# Altium schematic sheet CPU - Power.SchDoc: Title
size Tabloid; Revision: A; ProjectTitle: CDU: CAN Display Unit
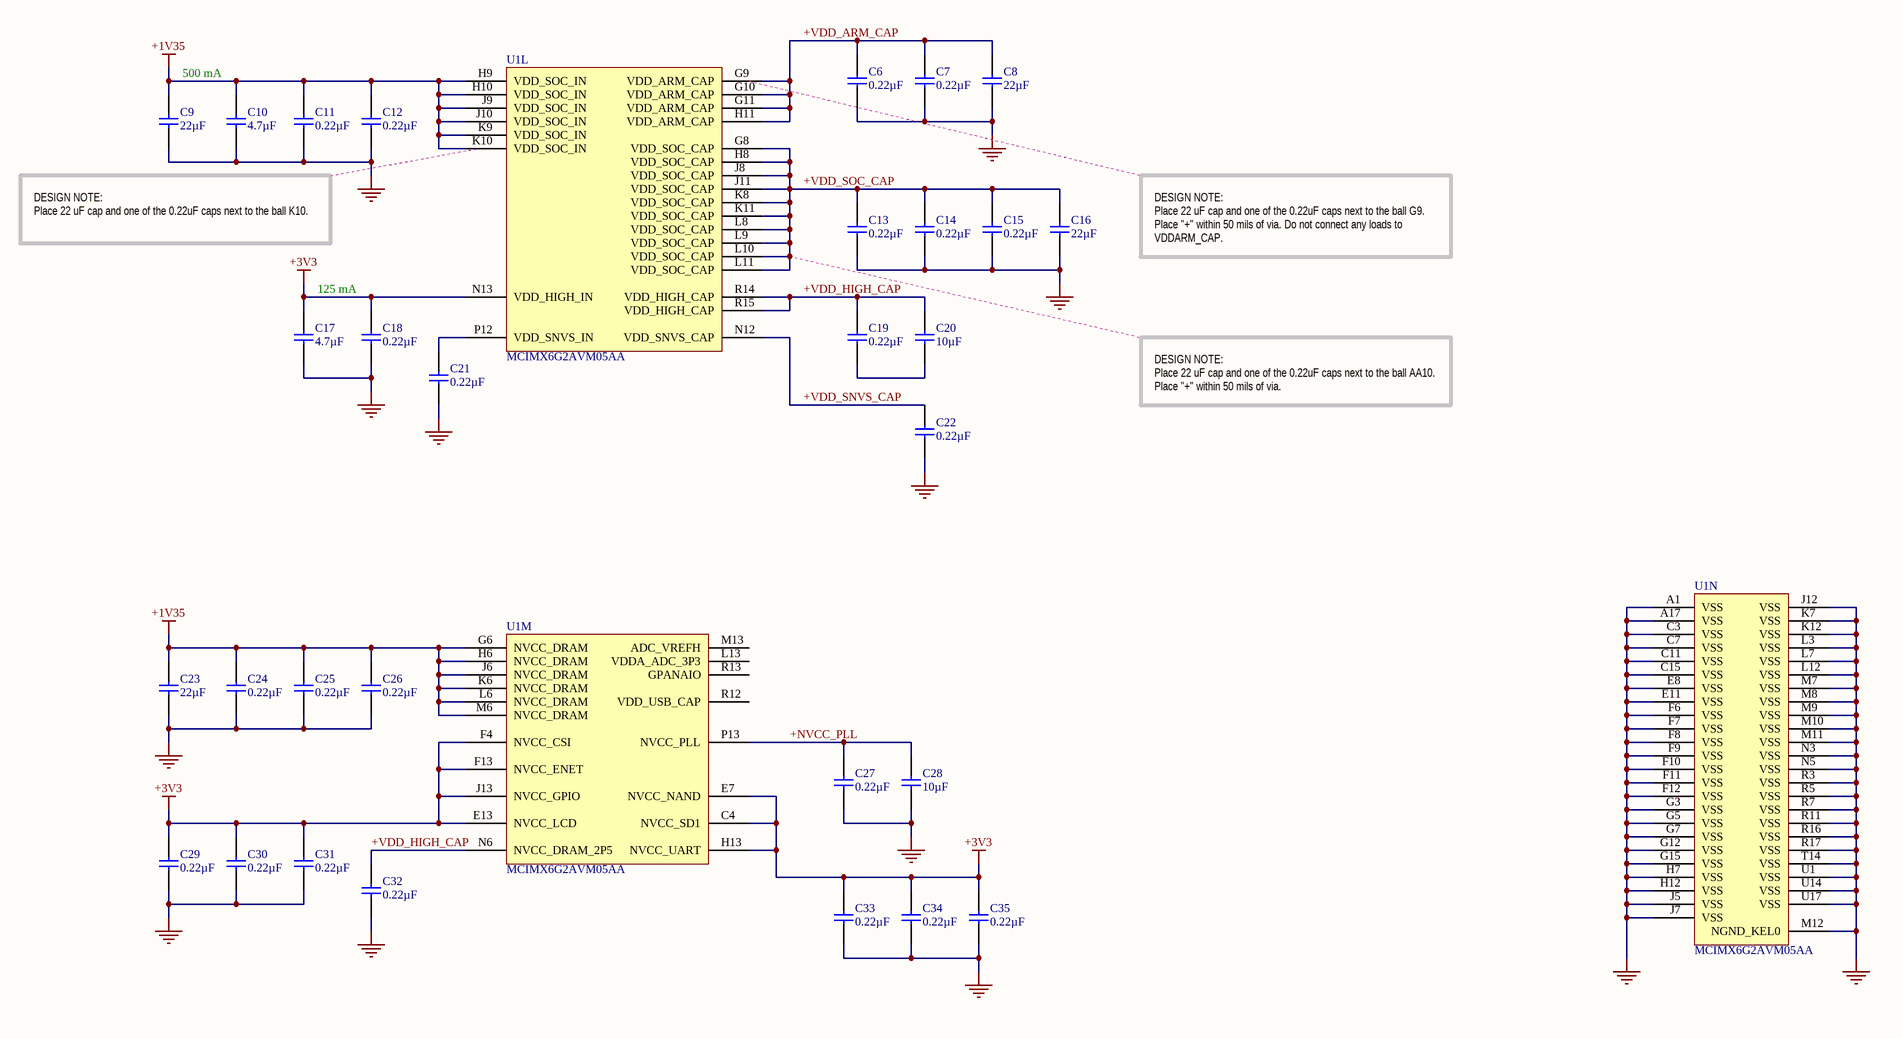
[diagram p0: CPU - Power.SchDoc]

## Parts
C6  value 0.22µF  [CAP-0402-M]  (hidden comment: Capacitor)
C7  value 0.22µF  [CAP-0402-M]  (hidden comment: Capacitor)
C8  value 22µF  [CAP-0603-M]  (hidden comment: CAP 22µF ±20% 10V 0603 X5R)
C9  value 22µF  [CAP-0603-M]  (hidden comment: CAP 22µF ±20% 10V 0603 X5R)
C10  value 4.7µF  [CAP-0402-M]  (hidden comment: Capacitor)
C11  value 0.22µF  [CAP-0402-M]  (hidden comment: Capacitor)
C12  value 0.22µF  [CAP-0402-M]  (hidden comment: Capacitor)
C13  value 0.22µF  [CAP-0402-M]  (hidden comment: Capacitor)
C14  value 0.22µF  [CAP-0402-M]  (hidden comment: Capacitor)
C15  value 0.22µF  [CAP-0402-M]  (hidden comment: Capacitor)
C16  value 22µF  [CAP-0603-M]  (hidden comment: CAP 22µF ±20% 10V 0603 X5R)
C17  value 4.7µF  [CAP-0402-M]  (hidden comment: Capacitor)
C18  value 0.22µF  [CAP-0402-M]  (hidden comment: Capacitor)
C19  value 0.22µF  [CAP-0402-M]  (hidden comment: Capacitor)
C20  value 10µF  [CAP-0603-M]  (hidden comment: CAP 10µF ±20% 6.3V 0603 X5R)
C21  value 0.22µF  [CAP-0402-M]  (hidden comment: Capacitor)
C22  value 0.22µF  [CAP-0402-M]  (hidden comment: Capacitor)
C23  value 22µF  [CAP-0603-M]  (hidden comment: CAP 22µF ±20% 10V 0603 X5R)
C24  value 0.22µF  [CAP-0402-M]  (hidden comment: Capacitor)
C25  value 0.22µF  [CAP-0402-M]  (hidden comment: Capacitor)
C26  value 0.22µF  [CAP-0402-M]  (hidden comment: Capacitor)
C27  value 0.22µF  [CAP-0402-M]  (hidden comment: Capacitor)
C28  value 10µF  [CAP-0603-M]  (hidden comment: CAP 10µF ±20% 6.3V 0603 X5R)
C29  value 0.22µF  [CAP-0402-M]  (hidden comment: Capacitor)
C30  value 0.22µF  [CAP-0402-M]  (hidden comment: Capacitor)
C31  value 0.22µF  [CAP-0402-M]  (hidden comment: Capacitor)
C32  value 0.22µF  [CAP-0402-M]  (hidden comment: Capacitor)
C33  value 0.22µF  [CAP-0402-M]  (hidden comment: Capacitor)
C34  value 0.22µF  [CAP-0402-M]  (hidden comment: Capacitor)
C35  value 0.22µF  [CAP-0402-M]  (hidden comment: Capacitor)
U1  MCIMX6G2AVM05AA  [BGA289C80P17X17_1400X1400X132]  (parts L,M,N of 14)

## Nets
+1V35: C9.2 C10.2 C11.2 C12.2 C23.2 C24.2 C25.2 C26.2 U1.G6(NVCC_DRAM) U1.H6(NVCC_DRAM) U1.H9(VDD_SOC_IN) U1.H10(VDD_SOC_IN) U1.J6(NVCC_DRAM) U1.J9(VDD_SOC_IN) U1.J10(VDD_SOC_IN) U1.K6(NVCC_DRAM) U1.K9(VDD_SOC_IN) U1.K10(VDD_SOC_IN) U1.L6(NVCC_DRAM) U1.M6(NVCC_DRAM)
+3V3: C17.2 C18.2 C29.2 C30.2 C31.2 C33.2 C34.2 C35.2 U1.C4(NVCC_SD1) U1.E7(NVCC_NAND) U1.E13(NVCC_LCD) U1.F4(NVCC_CSI) U1.F13(NVCC_ENET) U1.H13(NVCC_UART) U1.J13(NVCC_GPIO) U1.N13(VDD_HIGH_IN)
GND: C6.1 C7.1 C8.1 C9.1 C10.1 C11.1 C12.1 C13.1 C14.1 C15.1 C16.1 C17.1 C18.1 C21.1 C22.1 C23.1 C24.1 C25.1 C26.1 C27.1 C28.1 C29.1 C30.1 C31.1 C32.1 C33.1 C34.1 C35.1 U1.A1(VSS) U1.A17(VSS) U1.C3(VSS) U1.C7(VSS) U1.C11(VSS) U1.C15(VSS) U1.E8(VSS) U1.E11(VSS) U1.F6(VSS) U1.F7(VSS) U1.F8(VSS) U1.F9(VSS) U1.F10(VSS) U1.F11(VSS) U1.F12(VSS) U1.G3(VSS) U1.G5(VSS) U1.G7(VSS) U1.G12(VSS) U1.G15(VSS) U1.H7(VSS) U1.H12(VSS) U1.J5(VSS) U1.J7(VSS) U1.J12(VSS) U1.K7(VSS) U1.K12(VSS) U1.L3(VSS) U1.L7(VSS) U1.L12(VSS) U1.M7(VSS) U1.M8(VSS) U1.M9(VSS) U1.M10(VSS) U1.M11(VSS) U1.M12(NGND_KEL0) U1.N3(VSS) U1.N5(VSS) U1.R3(VSS) U1.R5(VSS) U1.R7(VSS) U1.R11(VSS) U1.R16(VSS) U1.R17(VSS) U1.T14(VSS) U1.U1(VSS) U1.U14(VSS) U1.U17(VSS)
+NVCC_PLL: C27.2 C28.2 U1.P13(NVCC_PLL)
+VDD_ARM_CAP: C6.2 C7.2 C8.2 U1.G9(VDD_ARM_CAP) U1.G10(VDD_ARM_CAP) U1.G11(VDD_ARM_CAP) U1.H11(VDD_ARM_CAP)
+VDD_HIGH_CAP: C19.2 C20.2 C32.2 U1.N6(NVCC_DRAM_2P5) U1.R14(VDD_HIGH_CAP) U1.R15(VDD_HIGH_CAP)
+VDD_SNVS_CAP: C22.2 U1.N12(VDD_SNVS_CAP)
+VDD_SOC_CAP: C13.2 C14.2 C15.2 C16.2 U1.G8(VDD_SOC_CAP) U1.H8(VDD_SOC_CAP) U1.J8(VDD_SOC_CAP) U1.J11(VDD_SOC_CAP) U1.K8(VDD_SOC_CAP) U1.K11(VDD_SOC_CAP) U1.L8(VDD_SOC_CAP) U1.L9(VDD_SOC_CAP) U1.L10(VDD_SOC_CAP) U1.L11(VDD_SOC_CAP)
NetC19_1: C19.1 C20.1
NetC21_2: C21.2 U1.P12(VDD_SNVS_IN)

Not connected (* = marked no-connect by the designer): U1 L13(VDDA_ADC_3P3) M13(ADC_VREFH) R12(VDD_USB_CAP) R13(GPANAIO)

## Notes on the sheet
- 500 mA
- DESIGN NOTE:
  Place 22 uF cap and one of the 0.22uF caps next to the ball K10.
- DESIGN NOTE:
  Place 22 uF cap and one of the 0.22uF caps next to the ball G9. Place "+" within 50 mils of via. Do not connect any loads to VDDARM_CAP.
- 125 mA
- DESIGN NOTE:
  Place 22 uF cap and one of the 0.22uF caps next to the ball AA10. Place "+" within 50 mils of via.
- Date:
- Revision:
- Sheet:
- /

## Library data of the parts
C6 C7 C11-C15 C18 C19 C21 C22 C24-C27 C29-C35 = CC0402KRX5R5BB224: Manufacturer: Yageo; Manufacturer Series: CC; Tolerance: ±10%; Voltage: 6.3V; Temperature Coefficient: X5R; Part Number: CC0402KRX5R5BB224; Component Type: Standard; Package: 0402; Temperature Range: -55°C ~ 85°C; Supplier 1: Digi-Key; Supplier Part Number 1: 311-1681-1-ND
C8 C9 C16 C23 = CC0603MRX5R6BB226: Manufacturer: Yageo; Manufacturer Series: CC; Part Number: CC0603MRX5R6BB226; Component Type: Standard; Tolerance: ±20%; Voltage: 10V; Package: 0603; Temperature Coefficient: X5R; Temperature Range: -55°C ~ 85°C; Supplier 1: Digi-Key; Supplier Part Number 1: 311-1819-1-ND
C10 C17 = CC0402MRX5R5BB475: Manufacturer: Murata; Manufacturer Series: GRM; Tolerance: ±20%; Voltage: 6.3V; Temperature Coefficient: X5R; Part Number: CC0402MRX5R5BB475; Component Type: Standard; Package: 0402; Temperature Range: -55°C ~ 85°C; Supplier 1: Digi-Key; Supplier Part Number 1: 311-1730-1-ND
C20 C28 = CC0603MRX5R5BB106: Manufacturer: Yageo; Manufacturer Series: CC; Part Number: CC0603MRX5R5BB106; Component Type: Standard; Tolerance: ±20%; Voltage: 6.3V; Package: 0603; Temperature Coefficient: X5R; Temperature Range: -55°C ~ 85°C; Supplier 1: Digi-Key; Supplier Part Number 1: 311-1448-1-ND